# EasyEDA Pro project ProDocument_PCB26_2025-02-21.epro

# Board PCB26
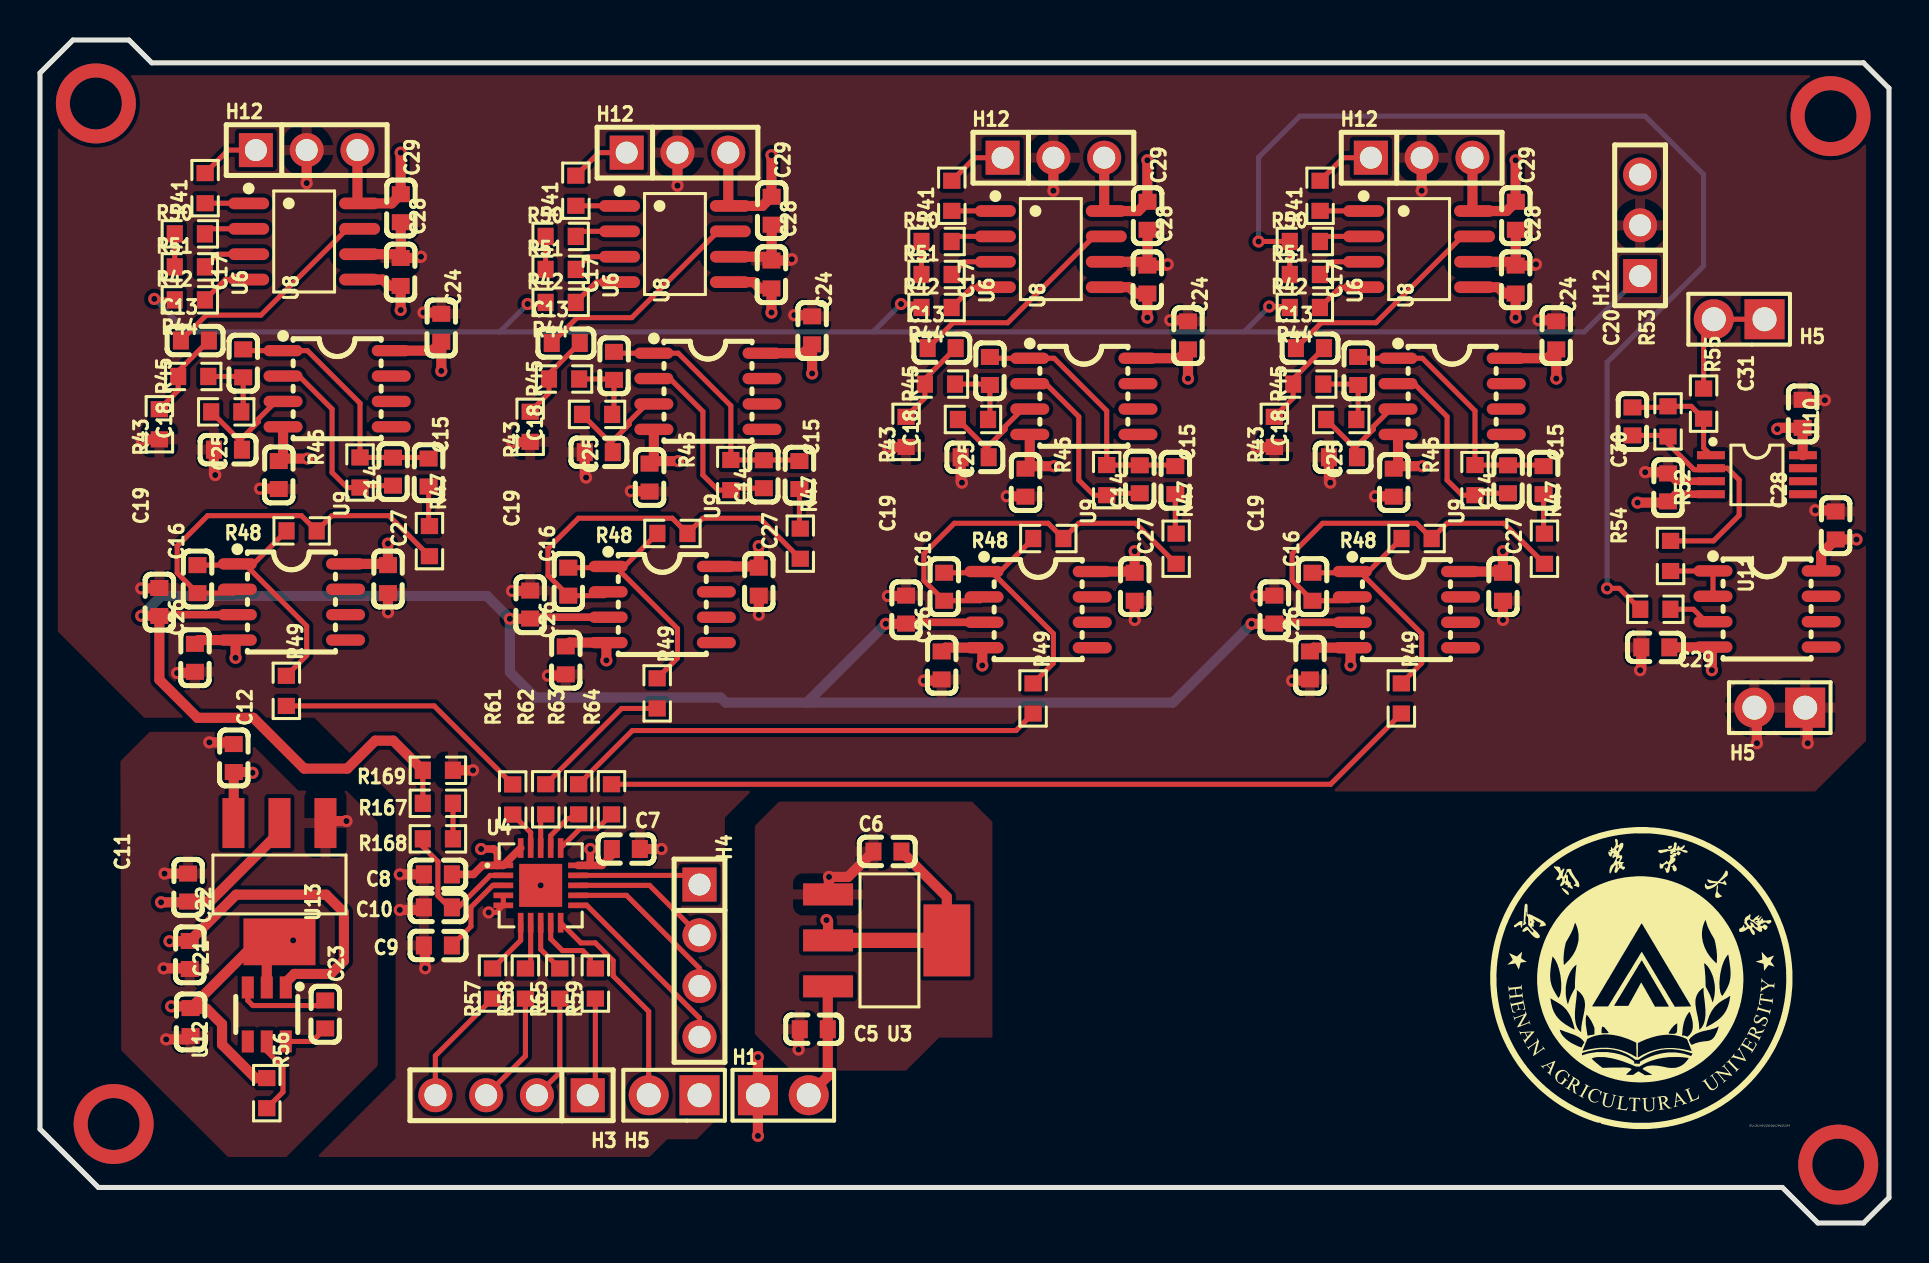
[diagram p0: board, top side]
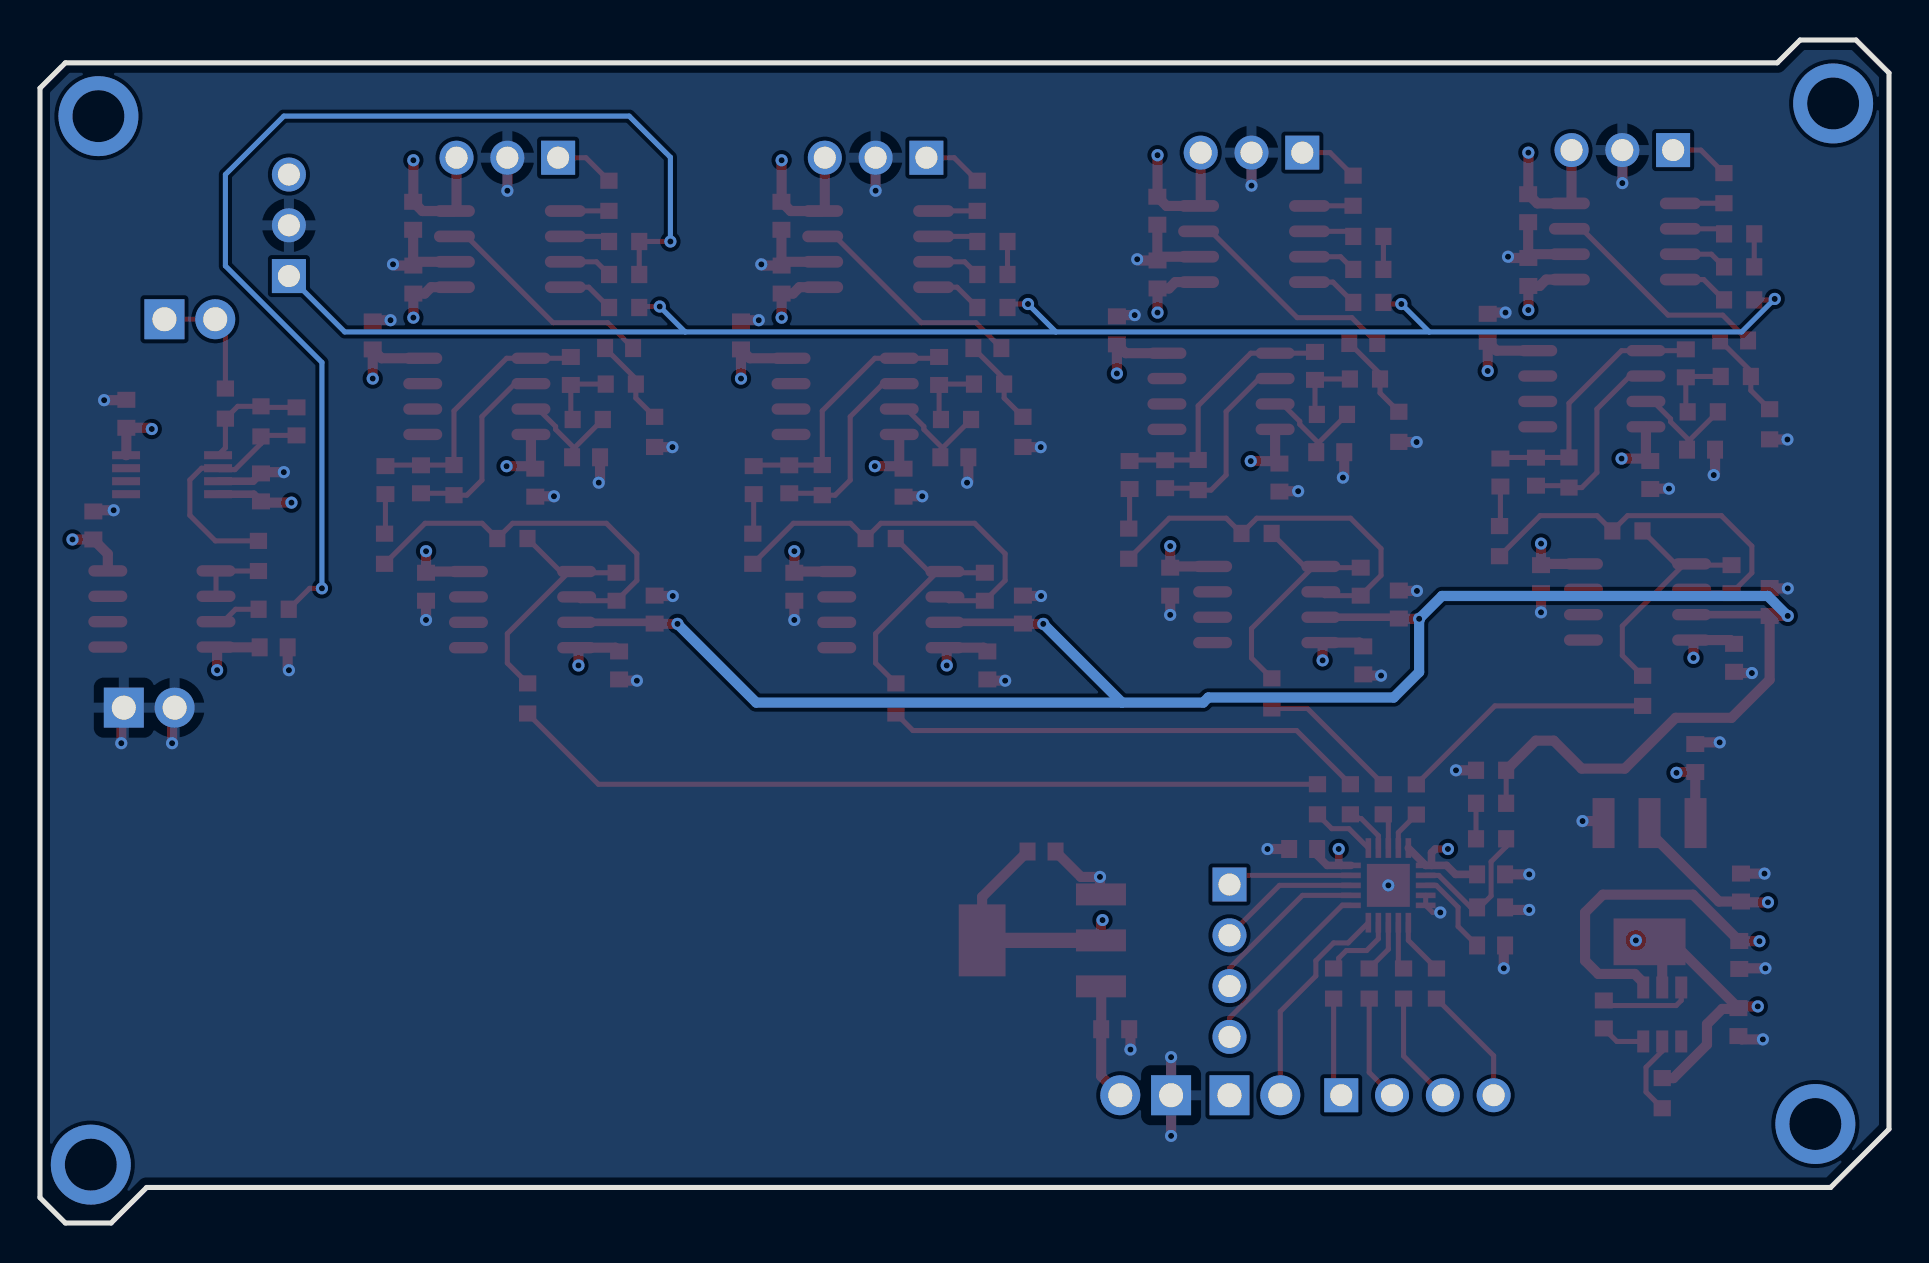
[diagram p1: board, bottom side, seen from below]

Outline 92.46 x 59.18 mm; copper layers: Top Layer, Inner1, Inner2, Bottom Layer. Coordinates in mm from the lower left corner of the outline.
Outline path: 0,57.53 1.65,59.18 4.44,59.18 5.59,58.04 91.19,58.04 92.46,56.77 92.46,1.27 91.19,0 88.9,0 87.12,1.78 2.92,1.78 0,4.7 0,57.53
Stack: Top Layer 0.035mm / Dielectric1 1.51mm FR4 er 4.5 / Inner1 0.035mm / Dielectric2 0.48mm PP er 4.5 / Inner2 0.035mm / Dielectric3 0.48mm PP er 4.5 / Bottom Layer 0.035mm

## Design rules (mm)
template: JLCPCB Capability(Two Layers Board)
spacing copperThickness1oz (default): track to track 0.102, other pairs 0.152 to 0.3
spacing copperThickness2oz: track to track 0.203, other pairs 0.152 to 0.3
track width copperThickness1oz (default): min 0.127, default 0.254, max 2.54
track width copperThickness2oz: min 0.203, default 0.254, max 2.54
differential pair differentialPair (default): width min 0.127, default 0.254, max 2.54; gap min 0.152, default 0.152
via viaSize (default): diameter min 0.5, default 0.61, max 10; hole min 0.3, default 0.305, max 6.3

## Placement (name value [footprint] x y rotation side)
C5  10uF  [C0603]  38.69 9.69 0 top
C6  22uF  [C0603]  42.38 18.58 0 top
C7  100nF  [C0603]  29.29 18.71 180 top
C8  100nF  [C0603]  19.9 17.44 0 top
C9  100nF  [C0603]  19.9 13.88 180 top
C10  100nF  [C0603]  19.9 15.79 180 top
C11  22uF  [C0603]  7.4 16.78 270 top
C12  10uF  [C0603]  9.69 23.26 270 top
C13  -  [C0603]  7.75 44.15 180 top
C13#2  -  [C0603]  26.29 44.02 180 top
C13#3  -  [C0603]  63.5 43.77 180 top
C13#4  -  [C0603]  45.09 43.77 180 top
C14  -  [C0603]  17.65 37.59 270 top
C14#2  -  [C0603]  54.99 37.2 270 top
C14#3  -  [C0603]  36.19 37.46 270 top
C14#4  -  [C0603]  73.41 37.2 270 top
C15  -  [C0603]  19.43 37.54 90 top
C15#2  -  [C0603]  37.97 37.42 90 top
C15#3  -  [C0603]  56.77 37.16 90 top
C15#4  -  [C0603]  75.18 37.16 90 top
C16  -  [C0603]  63.63 31.83 270 top
C16#2  -  [C0603]  7.87 32.21 270 top
C16#3  -  [C0603]  26.42 32.08 270 top
C16#4  -  [C0603]  45.21 31.83 270 top
C17  -  [C0603]  10.16 43.01 270 top
C17#2  -  [C0603]  28.7 42.88 270 top
C17#3  -  [C0603]  65.91 42.62 270 top
C17#4  -  [C0603]  47.5 42.62 270 top
C18  -  [C0603]  27.94 38.56 180 top
C18#2  -  [C0603]  9.4 38.69 180 top
C18#3  -  [C0603]  65.15 38.31 180 top
C18#4  -  [C0603]  46.74 38.31 180 top
C19  -  [C0603]  61.72 30.69 90 top
C19#2  -  [C0603]  5.97 31.07 90 top
C19#3  -  [C0603]  24.51 30.94 90 top
C19#4  -  [C0603]  43.31 30.69 90 top
C20  68pF  [C0603]  79.63 40.1 90 top
C21  4.7uF  [C0603]  7.53 10.05 270 top
C22  4.7uF  [C0603]  7.49 13.41 270 top
C23  4.7uF  [C0603]  14.26 10.43 270 top
C24  -  [C0603]  20.07 44.78 90 top
C24#2  -  [C0603]  38.61 44.66 90 top
C24#3  -  [C0603]  57.4 44.4 90 top
C24#4  -  [C0603]  75.82 44.4 90 top
C25  -  [C0603]  11.94 37.42 270 top
C25#2  -  [C0603]  49.28 37.04 270 top
C25#3  -  [C0603]  30.48 37.29 270 top
C25#4  -  [C0603]  67.69 37.04 270 top
C26  -  [C0603]  7.75 28.27 270 top
C26#2  -  [C0603]  63.5 27.89 270 top
C26#3  -  [C0603]  26.29 28.15 270 top
C26#4  -  [C0603]  45.09 27.89 270 top
C27  -  [C0603]  17.4 32.21 270 top
C27#2  -  [C0603]  73.15 31.83 270 top
C27#3  -  [C0603]  35.94 32.08 270 top
C27#4  -  [C0603]  54.74 31.83 270 top
C28  -  [C0603]  89.79 34.89 90 top
C28#2  -  [C0603]  18.03 47.58 90 top
C28#3  -  [C0603]  36.58 47.45 90 top
C28#4  -  [C0603]  73.79 47.2 90 top
C28#5  -  [C0603]  55.37 47.2 90 top
C29  -  [C0603]  18.04 50.77 270 top
C29#2  -  [C0603]  80.77 28.8 180 top
C29#3  -  [C0603]  36.59 50.64 270 top
C29#4  -  [C0603]  55.38 50.39 270 top
C29#5  -  [C0603]  73.8 50.39 270 top
C30  100nF  [C0603]  81.41 36.8 90 top
C31  100nF  [C0603]  88.14 40.48 90 top
H1  PZ254V-11-02P  [HDR-TH_2P-P2.54-V-M]  37.17 6.39 0 top
H3  PZ254V-11-04P  [HDR-TH_4P-P2.54-V-M]  23.58 6.39 180 top
H4  PZ254V-11-04P  [HDR-TH_4P-P2.54-V-M]  32.98 13.12 270 top
H5  -  [HDR-TH_2P-P2.54-V-M]  31.71 6.39 180 top
H5#2  -  [HDR-TH_2P-P2.54-V-M]  84.96 45.21 180 top
H5#3  -  [HDR-TH_2P-P2.54-V-M]  87 25.78 180 top
H12  -  [HDR-TH_3P-P2.54-V-M]  50.67 53.29 0 top
H12#2  -  [HDR-TH_3P-P2.54-V-M]  13.33 53.67 0 top
H12#3  -  [HDR-TH_3P-P2.54-V-M]  80.01 49.91 90 top
H12#4  -  [HDR-TH_3P-P2.54-V-M]  31.88 53.55 0 top
H12#5  -  [HDR-TH_3P-P2.54-V-M]  69.09 53.29 0 top
R41  -  [R0603]  8.25 51.77 90 top
R41#2  -  [R0603]  45.59 51.39 90 top
R41#3  -  [R0603]  26.8 51.64 90 top
R41#4  -  [R0603]  64.01 51.39 90 top
R42  -  [R0603]  7.49 46.18 180 top
R42#2  -  [R0603]  26.03 46.05 180 top
R42#3  -  [R0603]  63.25 45.8 180 top
R42#4  -  [R0603]  44.83 45.8 180 top
R43  -  [R0603]  24.51 39.83 270 top
R43#2  -  [R0603]  5.97 39.96 270 top
R43#3  -  [R0603]  43.31 39.58 270 top
R43#4  -  [R0603]  61.72 39.58 270 top
R44  -  [R0603]  7.66 42.35 0 top
R44#2  -  [R0603]  26.2 42.22 0 top
R44#3  -  [R0603]  63.42 41.97 0 top
R44#4  -  [R0603]  45 41.97 0 top
R45  -  [R0603]  9.31 40.58 180 top
R45#2  -  [R0603]  27.86 40.45 180 top
R45#3  -  [R0603]  65.07 40.2 180 top
R45#4  -  [R0603]  46.65 40.2 180 top
R46  -  [R0603]  34.54 37.42 90 top
R46#2  -  [R0603]  16 37.54 90 top
R46#3  -  [R0603]  53.34 37.16 90 top
R46#4  -  [R0603]  71.75 37.16 90 top
R47  -  [R0603]  19.47 34.11 270 top
R47#2  -  [R0603]  75.23 33.73 270 top
R47#3  -  [R0603]  56.81 33.73 270 top
R47#4  -  [R0603]  38.02 33.98 270 top
R48  -  [R0603]  13.08 34.62 180 top
R48#2  -  [R0603]  31.62 34.5 180 top
R48#3  -  [R0603]  68.83 34.24 180 top
R48#4  -  [R0603]  50.42 34.24 180 top
R49  -  [R0603]  12.32 26.62 270 top
R49#2  -  [R0603]  30.86 26.5 270 top
R49#3  -  [R0603]  68.07 26.24 270 top
R49#4  -  [R0603]  49.66 26.24 270 top
R50  -  [R0603]  7.49 49.48 180 top
R50#2  -  [R0603]  26.03 49.36 180 top
R50#3  -  [R0603]  63.25 49.1 180 top
R50#4  -  [R0603]  44.83 49.1 180 top
R51  -  [R0603]  7.49 47.83 180 top
R51#2  -  [R0603]  26.03 47.7 180 top
R51#3  -  [R0603]  63.25 47.45 180 top
R51#4  -  [R0603]  44.83 47.45 180 top
R52  10kΩ  [R0603]  81.53 33.37 270 top
R53  470kΩ  [R0603]  81.41 40.1 270 top
R54  0Ω  [R0603]  80.77 30.7 180 top
R55  470kΩ  [R0603]  83.19 40.99 270 top
R56  10kΩ  [R0603]  11.34 6.5 90 top
R57  0Ω  [R0603]  22.63 11.98 270 top
R58  0Ω  [R0603]  24.27 11.98 270 top
R59  0Ω  [R0603]  27.77 11.98 270 top
R61  0Ω  [R0603]  23.64 21.19 270 top
R62  0Ω  [R0603]  25.29 21.2 270 top
R63  0Ω  [R0603]  26.93 21.2 90 top
R64  0Ω  [R0603]  28.58 21.2 90 top
R65  0Ω  [R0603]  25.99 11.98 90 top
R167  470kΩ  [R0603]  19.9 21 180 top
R168  0Ω  [R0603]  19.9 19.22 0 top
R169  470kΩ  [R0603]  19.9 22.65 0 top
U3  AMS1117-3.3  [SOT-223-3_L6.4-W3.5-P2.30-LS7.0-BR]  42.38 14.14 180 top
U4  AD7689BCPZ  [LFCSP-20_L4.0-W4.0-P0.50-TL-EP2.7]  25.03 16.89 0 top
U6  -  [SOIC-8_L4.9-W3.9-P1.27-LS6.0-BL]  13.21 49.1 270 top
U6#2  -  [SOIC-8_L4.9-W3.9-P1.27-LS6.0-BL]  31.75 48.97 270 top
U6#3  -  [SOIC-8_L4.9-W3.9-P1.27-LS6.0-BL]  50.55 48.72 270 top
U6#4  -  [SOIC-8_L4.9-W3.9-P1.27-LS6.0-BL]  68.96 48.72 270 top
U8  -  [SOIC-8_L4.9-W3.9-P1.27-LS6.1-BL]  14.86 41.74 270 top
U8#2  -  [SOIC-8_L4.9-W3.9-P1.27-LS6.1-BL]  33.4 41.61 270 top
U8#3  -  [SOIC-8_L4.9-W3.9-P1.27-LS6.1-BL]  70.61 41.35 270 top
U8#4  -  [SOIC-8_L4.9-W3.9-P1.27-LS6.1-BL]  52.2 41.35 270 top
U9  -  [SOIC-8_L4.9-W3.9-P1.27-LS6.1-BL]  12.57 31.07 270 top
U9#2  -  [SOIC-8_L4.9-W3.9-P1.27-LS6.1-BL]  31.12 30.94 270 top
U9#3  -  [SOIC-8_L4.9-W3.9-P1.27-LS6.1-BL]  49.91 30.69 270 top
U9#4  -  [SOIC-8_L4.9-W3.9-P1.27-LS6.1-BL]  68.33 30.69 270 top
U10  OP2177ARMZ-REEL  [MSOP-8_L3.0-W3.0-P0.65-LS4.9-BL]  85.85 37.43 270 top
U11  TL072CDR  [SOIC-8_L4.9-W3.9-P1.27-LS6.1-BL]  86.36 30.72 270 top
U12  SGM3204YN6G/TR  [SOT-23-6_L2.9-W1.6-P0.95-LS2.8-BR]  11.34 10.43 90 top
U13  AMS1117-3.3  [SOT-223-3_L6.4-W3.5-P2.30-LS7.0-BR]  11.97 17.04 90 top

## Footprints (pads in the part's own frame, mm; a bottom-side part is the same pattern mirrored in y, then rotated)
C0603
  rect 0.8x0.9 smd: 1(-0.7,0) 2(0.7,0)
HDR-TH_2P-P2.54-V-M
  rect 2x2 hole 1.2: 1(-1.27,0)
  round 2 hole 1.2: 2(1.27,0)
HDR-TH_3P-P2.54-V-M
  rect 1.7x1.7 hole 1.1: 1(-2.54,0)
  round 1.7 hole 1.1: 2(0,0) 3(2.54,0)
HDR-TH_4P-P2.54-V-M
  rect 1.7x1.7 hole 1.1: 1(-3.81,0)
  round 1.7 hole 1.1: 2(-1.27,0) 3(1.27,0) 4(3.81,0)
LFCSP-20_L4.0-W4.0-P0.50-TL-EP2.7
  rect 0.985x0.28 smd: 1(-1.867,1) 2(-1.867,0.5) 3(-1.867,0) 4(-1.867,-0.5) 5(-1.867,-1) 11(1.867,-1) 12(1.867,-0.5) 13(1.867,0) 14(1.867,0.5) 15(1.867,1)
  rect 0.28x0.985 smd: 6(-1,-1.867) 7(-0.5,-1.867) 8(0,-1.867) 9(0.5,-1.867) 10(1,-1.867) 16(1,1.867) 17(0.5,1.867) 18(0,1.867) 19(-0.5,1.867) 20(-1,1.867)
  rect 2.15x2.15 smd: 21(0,0)
MSOP-8_L3.0-W3.0-P0.65-LS4.9-BL
  rect 0.406x1.397 smd: 1(-0.975,-2.3) 2(-0.325,-2.3) 3(0.325,-2.3) 4(0.975,-2.3) 5(0.975,2.3) 6(0.325,2.3) 7(-0.325,2.3) 8(-0.975,2.3)
R0603
  rect 0.806x0.864 smd: 1(-0.753,0) 2(0.753,0)
SOIC-8_L4.9-W3.9-P1.27-LS6.0-BL
  oval 0.588x2.045 smd: 1(-1.905,-2.772) 2(-0.635,-2.772) 3(0.635,-2.772) 4(1.905,-2.772) 5(1.905,2.772) 6(0.635,2.772) 7(-0.635,2.772) 8(-1.905,2.772)
SOIC-8_L4.9-W3.9-P1.27-LS6.1-BL
  oval 0.569x1.95 smd: 1(-1.905,-2.705) 2(-0.635,-2.705) 3(0.635,-2.705) 4(1.905,-2.705) 5(1.905,2.705) 6(0.635,2.705) 7(-0.635,2.705) 8(-1.905,2.705)
SOT-23-6_L2.9-W1.6-P0.95-LS2.8-BR
  rect 1.1x0.6 smd: 1(1.35,-0.95) 2(1.35,0) 3(1.35,0.95) 4(-1.35,0.95) 5(-1.35,0) 6(-1.35,-0.95)
SOT-223-3_L6.4-W3.5-P2.30-LS7.0-BR
  rect 2.5x1.1 smd: 1(2.97,-2.3) 2(2.97,0) 3(2.97,2.3)
  rect 2.34x3.6 smd: 4(-2.97,0)

## Nets
+3.3V: C6.2 C7.2 U3.2 U3.4 U4.15
+5V: C5.2 C12.2 H1.2 U3.3 U13.3
AVCC: C8.2 C11.2 C21.1 C24.1 C24#2.1 C24#3.1 C24#4.1 C27.1 C27#2.1 C27#3.1 C27#4.1 C28.1 C29.1 C29#3.1 C29#4.1 C29#5.1 C31.1 H12.3 H12#2.3 H12#3.3 H12#4.3 H12#5.3 R56.2 U4.1 U4.20 U6.8 U6#2.8 U6#3.8 U6#4.8 U8.8 U8#2.8 U8#3.8 U8#4.8 U9.8 U9#2.8 U9#3.8 U9#4.8 U10.8 U11.8 U12.2 U13.2 U13.4
AVEE: C22.1 C25.1 C25#2.1 C25#3.1 C25#4.1 C26.1 C26#2.1 C26#3.1 C26#4.1 C28#2.1 C28#3.1 C28#4.1 C28#5.1 C29#2.1 C30.1 U6.5 U6#2.5 U6#3.5 U6#4.5 U8.4 U8#2.4 U8#3.4 U8#4.4 U9.4 U9#2.4 U9#3.4 U9#4.4 U10.4 U11.4 U12.1
GND: C5.1 C6.1 C7.1 C8.1 C9.2 C10.2 C11.1 C12.1 C18.2 C18#2.2 C18#3.2 C18#4.2 C19.2 C19#2.2 C19#3.2 C19#4.2 C21.2 C22.2 C24.2 C24#2.2 C24#3.2 C24#4.2 C25.2 C25#2.2 C25#3.2 C25#4.2 C26.2 C26#2.2 C26#3.2 C26#4.2 C27.2 C27#2.2 C27#3.2 C27#4.2 C28.2 C28#2.2 C28#3.2 C28#4.2 C28#5.2 C29.2 C29#2.2 C29#3.2 C29#4.2 C29#5.2 C30.2 C31.2 H1.1 H5#3.1 H5#3.2 H12.2 H12#2.2 H12#3.2 H12#4.2 H12#5.2 R43.2 R43#2.2 R43#3.2 R43#4.2 R169.2 U3.1 U4.4 U4.5 U4.21 U6.6 U6#2.6 U6#3.6 U6#4.6 U10.3 U13.1
ARF: C19.1 C19#2.1 C19#3.1 C19#4.1 R167.2 R169.1 U9.3 U9#2.3 U9#3.3 U9#4.3
COM: H5.2 U4.10
CVN: H4.4 U4.11
DIN: H4.3 U4.12
IN1: R49.2 R61.1
IN2: R49#2.2 R62.1
IN3: R49#4.2 R63.2
IN4: R49#3.2 R64.2
SCK: H4.2 U4.13
SDO: H4.1 U4.14
$1N550: R52.2 U11.1 U11.2
$1N551: R54.1 U11.3
$1N563: R50#3.2 R51#3.2 R54.2
$1N579: R56.1 U12.5
$1N581: C23.1 U12.3
$1N582: C23.2 U12.6
$1N1171: R41.1 R41#2.1 R41#3.1 R41#4.1 U6.1 U6#2.1 U6#3.1 U6#4.1
$1N1172: R42.1 R42#2.1 R42#3.1 R42#4.1 U6.4 U6#2.4 U6#3.4 U6#4.4
$1N1174: C14.2 C14#2.2 C14#3.2 C14#4.2 R46.1 R46#2.1 R46#3.1 R46#4.1 U8.2 U8#2.2 U8#3.2 U8#4.2
$1N1175: C13.1 C13#2.1 C13#3.1 C13#4.1 R43.1 R43#2.1 R43#3.1 R43#4.1 R44.1 R44#2.1 R44#3.1 R44#4.1
$1N1177: C13.2 C13#2.2 C13#3.2 C13#4.2 U6.7 U6#2.7 U6#3.7 U6#4.7
$1N1178: C15.1 C15#2.1 C15#3.1 C15#4.1 R47.1 R47#2.1 R47#3.1 R47#4.1
$1N1179: C16.2 C16#2.2 C16#3.2 C16#4.2 R47.2 R47#2.2 R47#3.2 R47#4.2 R48.1 R48#2.1 R48#3.1 R48#4.1 U9.2 U9#2.2 U9#3.2 U9#4.2
$1N1180: C16.1 C16#2.1 C16#3.1 C16#4.1 R48.2 R48#2.2 R48#3.2 R48#4.2 R49.1 R49#2.1 R49#3.1 R49#4.1 U9.1 U9#2.1 U9#3.1 U9#4.1
$1N1181: C14.1 C14#2.1 C14#3.1 C14#4.1 C15.2 C15#2.2 C15#3.2 C15#4.2 C17.1 C17#2.1 C17#3.1 C17#4.1 R46.2 R46#2.2 R46#3.2 R46#4.2 U8.1 U8#2.1 U8#3.1 U8#4.1
$1N1182: C17.2 C17#2.2 C17#3.2 C17#4.2 R44.2 R44#2.2 R44#3.2 R44#4.2 R45.1 R45#2.1 R45#3.1 R45#4.1
$1N1184: C18.1 C18#2.1 C18#3.1 C18#4.1 R45.2 R45#2.2 R45#3.2 R45#4.2 U8.3 U8#2.3 U8#3.3 U8#4.3
$1N1186: R50.1 R50#2.1 R50#3.1 R50#4.1 U6.2 U6#2.2 U6#3.2 U6#4.2
$1N1187: R51.1 R51#2.1 R51#3.1 R51#4.1 U6.3 U6#2.3 U6#3.3 U6#4.3
$1N1199: R50.2 R50#2.2 R50#4.2 R51.2 R51#2.2 R51#4.2
$1N1200: H12.1 H12#2.1 H12#4.1 H12#5.1 R41.2 R41#2.2 R41#3.2 R41#4.2
$1N1286: C9.1 U4.3
$1N1288: R57.1 U4.6
$1N1289: R58.1 U4.7
$1N1290: R59.1 U4.9
$1N1291: R61.2 U4.19
$1N1292: R62.2 U4.18
$1N1293: R63.1 U4.17
$1N1294: R64.1 U4.16
$1N1295: R65.2 U4.8
$1N1305: C10.1 R168.1 U4.2
$1N1306: R167.1 R168.2
$1N1316: H3.4 R57.2
$1N1581: H5#2.1 H5#2.2 R55.1
$1N2313: C20.1 R52.1 R53.2 U10.2
$1N2328: C20.2 R53.1 R55.2 U10.1
$1N6910: H3.3 R58.2
$1N6915: H3.2 R65.1
$1N6920: H3.1 R59.2
$1N10831: H12#3.1 R42.2 R42#2.2 R42#3.2 R42#4.2

Pads without a net: H5 1; U8 5 6 7; U8#2 5 6 7; U8#3 5 6 7; U8#4 5 6 7; U9 5 6 7; U9#2 5 6 7; U9#3 5 6 7; U9#4 5 6 7; U10 5 6 7; U11 5 6 7; U12 4

## Via types
v1: diameter 4, hole 2.6, Top Layer to Bottom Layer, 4 vias
v2: diameter 0.61, hole 0.305, Top Layer to Bottom Layer, 104 vias

## Routing (per net, layer and track width the routed paths; a pad name or vN(x,y) marks a point on that pad's centre or on a via; arc(x,y) is an arc through that point)
+3.3V: length 28.7
  Top Layer w0.381: 27.4,17.89 27.52,18.01 v2(27.52,18.71) ; 27.4,17.89 U4.15 ; 27.4,17.89 28.09,17.89 28.59,18.39 C7.2
  Top Layer w0.508: C6.2 45.35,16.31 U3.4 ; U3.2 39.41,15.08 v2(39.33,15.15)
  Top Layer w0.762: U3.2 U3.4
  Inner1 w0.508: v2(27.52,18.71) 30.55,15.68 38.81,15.68 v2(39.33,15.15)
+5V: length 64.9
  Top Layer w0.508: H1.2 39.39,7.35 C5.2 39.39,11.83 U3.3 ; v2(10.63,22.52) 10.59,22.56 C12.2 9.69,20.02 U13.3
  Inner1 w0.508: H1.2 38.44,4.11 37.93,3.6 10.63,3.6 4.32,9.91 4.32,18.03 8.81,22.52 v2(10.63,22.52)
AVCC: length 362.4
  Top Layer w0.381: 22.88,17.89 U4.1 U4.20 ; 22.88,17.89 22.12,17.89 21.67,17.44 C8.2 ; 22.88,17.89 22.88,18.53 22.69,18.71 v2(22.06,18.71)
  Top Layer w0.508: v2(90.83,34.19) C28.1 89.06,33.47 89.06,32.62 ; U10.8 88.14,38.42 C31.1 86.93,39.78 v2(86.87,39.72) ; v2(54.74,33.61) C27#4.1 54.68,32.59 U9#3.8 ; R56.2 10.78,7.25 9.1,8.93 9.1,9.95 8.34,10.71 7.57,10.71 C21.1 ; C21.1 7.44,10.84 v2(6.56,10.84) ; C21.1 10.84,14.07 U13.4 11.34,13.43 U12.2 ; U9.8 17.34,32.97 C27.1 v2(17.4,33.99) ; v2(55.37,53.17) 55.37,51.1 C29#4.1 54.92,50.63 U6#3.8 53.21,50.73 H12.3 ; H12#5.3 71.63,50.73 U6#4.8 73.34,50.63 C29#5.1 73.79,51.1 v2(73.79,53.17) ; U8#2.8 38.16,43.51 C24#2.1 v2(38.61,42.5) ; v2(18.03,53.55) 18.03,51.48 C29.1 17.58,51.01 U6.8 15.88,51.11 H12#2.3 ; v2(35.94,33.86) C27#3.1 35.88,32.85 U9#2.8 ; U9#4.8 73.09,32.59 C27#2.1 v2(73.15,33.61) ; v2(57.4,42.24) C24#3.1 56.96,43.26 U8#4.8 ; v2(20.07,42.62) C24.1 19.62,43.64 U8.8 ; v2(36.58,53.42) 36.58,51.35 36.59,51.34 36.12,50.88 U6#2.8 34.42,50.98 H12#4.3 ; v2(6.05,16.04) 7.36,16.04 C11.2 8.51,16.08 11.97,19.55 U13.2 ; v2(75.82,42.24) C24#4.1 75.38,43.26 U8#3.8
  Inner1 w0.508: v2(75.82,42.24) 76.96,43.39 76.96,49.77 ; v2(75.82,42.24) 76.71,41.35 76.71,36.27 ; v2(75.82,42.24) 84.34,42.24 v2(86.87,39.72) 86.87,38.16 87.72,37.31 89.79,37.31 90.83,36.27 v2(90.83,34.19) ; v2(6.05,16.04) 7.11,14.99 7.92,14.99 8.76,14.14 ; 39.75,50.24 v2(36.58,53.42) 33.53,50.37 21.21,50.37 ; 39.75,50.24 39.75,43.64 v2(38.61,42.5) 39.5,41.61 39.5,36.53 38.74,35.77 37.59,35.77 37.08,35.26 37.08,34.54 36.41,33.86 v2(35.94,33.86) ; 39.75,50.24 58.29,50.24 ; 21.21,50.37 21.21,43.77 v2(20.07,42.62) 20.95,41.74 20.95,36.66 20.19,35.89 19.05,35.89 18.54,35.39 18.54,34.67 17.86,33.99 v2(17.4,33.99) ; 21.21,50.37 v2(18.03,53.55) ; 8.76,14.14 v2(12.66,14.14) 17.23,18.71 20.15,18.71 ; 8.76,14.14 8.76,13.04 v2(6.56,10.84) ; 76.96,49.77 76.74,49.99 58.55,49.99 ; 76.96,49.77 76.96,49.99 v2(73.79,53.17) 79.3,53.17 H12#3.3 ; 76.71,36.27 75.95,35.51 74.8,35.51 74.29,35 74.29,34.29 73.62,33.61 v2(73.15,33.61) ; 76.71,36.27 76.71,24.89 74.17,22.35 23.79,22.35 20.15,18.71 ; 58.55,49.99 58.55,43.39 v2(57.4,42.24) 58.29,41.35 58.29,36.27 57.53,35.51 56.39,35.51 55.88,35 55.88,34.29 55.2,33.61 v2(54.74,33.61) ; 58.55,49.99 58.29,50.24 ; 58.29,50.24 v2(55.37,53.17) ; 20.15,18.71 v2(22.06,18.71)
AVEE: length 356.8
  Top Layer w0.381: U10.4 81.77,36.46 C30.1
  Top Layer w0.508: 49.4,37.86 C25#2.1 ; 49.4,37.86 v2(50.71,37.86) ; 49.4,37.86 49.49,37.95 U8#4.4 ; U6#4.5 72.9,46.82 73.22,46.5 C28#4.1 v2(73.79,45.29) ; U6#3.5 54.48,46.82 54.8,46.5 C28#5.1 v2(55.37,45.29) ; v2(18.03,45.67) C28#2.1 17.46,46.88 17.14,47.2 U6.5 ; 12.06,38.24 12.15,38.33 U8.4 ; 12.06,38.24 C25.1 ; 12.06,38.24 v2(13.37,38.24) ; 83.64,28.8 83.6,28.76 v2(83.6,27.66) ; 83.64,28.8 U11.4 ; 83.64,28.8 C29#2.1 ; C26#4.1 45.27,28.78 U9#3.4 47.12,28.69 v2(47.12,27.89) ; v2(65.53,27.89) 65.53,28.69 U9#4.4 63.69,28.78 C26#2.1 ; 30.6,38.11 C25#3.1 ; 30.6,38.11 v2(31.91,38.11) ; 30.6,38.11 30.7,38.21 U8#2.4 ; U6#2.5 35.69,47.07 36.01,46.75 C28#3.1 v2(36.58,45.55) ; 67.91,39.45 67.91,37.95 67.81,37.86 ; 67.81,37.86 C25#4.1 ; 67.81,37.86 v2(69.12,37.86) ; U12.1 12.29,12.03 12.72,12.46 14.53,12.46 15.2,13.12 15.2,15.54 14.31,16.42 9.8,16.42 C22.1 7.48,14.1 v2(6.48,14.1) ; C26#3.1 26.48,29.04 U9#2.4 28.32,28.95 v2(28.32,28.15) ; v2(79.88,36.04) 81.34,36.04 C30.1 ; v2(9.78,28.27) 9.78,29.07 U9.4 7.94,29.16 C26.1
  Inner1 w0.508: v2(47.12,27.89) 47.88,27.89 49.45,29.46 ; 49.45,29.46 44.07,29.46 43.05,28.45 32.42,28.45 31.91,28.96 31.91,30.98 ; 49.45,29.46 50.71,30.72 ; 31.91,30.98 31.91,35.02 ; 31.91,30.98 29.08,28.15 v2(28.32,28.15) ; 13.37,31.1 13.37,27.54 ; 13.37,31.1 v2(13.37,38.24) 13.37,41.01 v2(18.03,45.67) ; 13.37,31.1 10.54,28.27 v2(9.78,28.27) 3.43,21.92 3.43,8.89 9.78,2.54 38.35,2.54 53.97,18.16 72.64,18.16 82.14,27.66 v2(83.6,27.66) 83.47,27.78 81.03,27.78 79.88,28.93 v2(79.88,36.04) ; 13.37,27.54 13.88,27.03 17.63,27.03 25.65,35.05 31.88,35.05 31.91,35.02 ; 13.37,27.54 13.37,23.66 11.3,21.59 9.27,21.59 5.33,17.65 5.33,15.24 v2(6.48,14.1) ; v2(55.37,45.29) 50.71,40.63 v2(50.71,37.86) 50.71,30.72 ; v2(36.58,45.55) 31.91,40.88 v2(31.91,38.11) 31.91,35.02 ; 50.71,30.72 52.37,32.38 65.19,32.38 67.99,29.59 ; 67.99,29.59 69.12,30.72 v2(69.12,37.86) 69.12,40.63 v2(73.79,45.29) ; 67.99,29.59 66.29,27.89 v2(65.53,27.89)
GND: length 486.5
  Top Layer w0.254: v2(22.44,15.54) 22.81,15.54 U4.5 U4.4 ; 81.34,37.56 C30.2
  Top Layer w0.381: C30.2 81.8,37.11 U10.3
  Top Layer w0.508: C18#2.2 8.7,37.48 v2(8.76,37.42) ; v2(89.25,41.16) 88.16,41.16 C31.2 ; v2(29.54,36.61) 30.46,36.61 C25#3.2 ; H12.2 v2(50.67,51.64) ; v2(46.1,37.04) 46.04,37.1 C18#4.2 ; v2(48.34,36.36) 49.26,36.36 C25#2.2 ; C25#4.2 67.67,36.36 v2(66.76,36.36) ; v2(56.39,47.96) 56.33,47.9 C28#5.2 ; C5.1 37.93,9.63 v2(37.93,8.68) ; v2(80.26,37.56) 81.34,37.56 ; C24#2.2 38.55,45.42 v2(37.72,45.42) ; U3.1 39.45,16.49 v2(39.45,17.31) 40.41,17.31 C6.1 ; C29#5.2 73.8,47.91 C28#4.2 ; U6#2.6 36.39,48.34 C28#3.2 ; v2(73.15,30.17) 73.15,30.17 C27#2.2 ; C19.2 61.7,31.37 v2(60.82,31.37) ; C18.2 27.24,37.36 v2(27.31,37.29) ; v2(85.85,24) 85.85,25.65 H5#3.2 ; v2(64.52,37.04) 64.45,37.1 C18#3.2 ; C28#4.2 74.74,47.9 v2(74.8,47.96) ; C28#4.2 73.6,48.09 U6#4.6 ; v2(19.05,48.34) 18.99,48.28 C28#2.2 ; v2(44.2,27.13) 45.02,27.13 C26#4.2 ; v2(5.06,31.75) 5.95,31.75 C19#2.2 ; v2(56.51,45.16) 57.34,45.16 C24#3.2 ; v2(5.08,39.2) 5.96,39.2 R43#2.2 ; v2(6.86,27.51) 7.69,27.51 C26.2 ; C29#3.2 36.59,48.16 C28#3.2 ; v2(17.99,15.66) 19.2,15.66 ; C27#4.2 54.74,30.17 v2(54.74,30.17) ; v2(42.42,38.81) 43.3,38.81 R43#3.2 ; v2(17.4,30.55) 17.4,30.55 C27.2 ; C19#3.2 24.49,31.62 v2(23.61,31.62) ; v2(88.39,24) 88.39,25.65 88.26,25.78 ; v2(42.4,31.37) 43.29,31.37 C19#4.2 ; v2(31.08,18.71) 31.07,18.71 C7.1 ; C28#2.2 18.04,48.29 C29.2 ; C28#2.2 17.84,48.47 U6.6 ; C11.1 7.4,17.48 v2(6.23,17.48) ; U13.1 14.38,20.11 v2(15.32,20.11) ; v2(25.4,27.38) 26.23,27.38 C26#3.2 ; R43#4.2 61.71,38.81 v2(60.83,38.81) ; H12#4.2 v2(31.88,51.9) ; v2(35.9,4.36) H1.1 v2(35.9,8.3) ; v2(6.18,12.74) 7.46,12.74 C22.2 ; v2(88.77,35.66) 89.73,35.66 C28.2 ; C12.1 9.6,24.04 v2(8.47,24.04) ; C27#3.2 35.94,30.43 v2(35.94,30.42) ; v2(19.18,45.55) 20,45.55 C24.2 ; R43.2 24.5,39.07 v2(23.62,39.07) ; C29#2.2 80.07,27.72 v2(80.01,27.66) ; C28#3.2 37.53,48.15 v2(37.59,48.21) ; C24#4.2 75.76,45.16 v2(74.93,45.16) ; C26#2.2 63.44,27.13 v2(62.61,27.13) ; C25.2 11.92,36.74 v2(11,36.74) ; C9.2 19.26,13.82 v2(19.26,12.74) ; v2(17.99,17.44) C8.1 ; C28#5.2 55.38,47.91 C29#4.2 ; C28#5.2 55.18,48.09 U6#3.6 ; H12#5.2 v2(69.09,51.64) ; R169.2 v2(21.65,22.65) ; v2(6.31,9.19) 7.36,9.19 C21.2 ; H12#2.2 v2(13.33,52.02)
  Inner2 w0.508: v2(31.88,51.9) 35.56,48.21 v2(37.59,48.21) 37.59,45.55 v2(37.72,45.42) 29.54,37.24 v2(29.54,36.61) ; v2(74.8,47.96) 78.06,47.96 H12#3.2 ; v2(74.8,47.96) 74.8,45.29 v2(74.93,45.16) 66.76,36.99 v2(66.76,36.36) ; v2(74.8,47.96) 72.77,47.96 v2(69.09,51.64) ; 77.99,27.66 v2(80.01,27.66) 80.77,27.66 v2(88.77,35.66) ; 77.99,27.66 75.67,27.66 v2(73.15,30.17) 72.94,30.17 v2(66.76,36.36) ; 77.99,27.66 81.64,24 v2(85.85,24) v2(88.39,24) ; v2(13.33,52.02) 17.02,48.34 v2(19.05,48.34) 19.05,45.67 v2(19.18,45.55) 11,37.37 v2(11,36.74) ; v2(27.31,37.29) 27.31,35.32 ; v2(27.31,37.29) 25.4,37.29 v2(23.62,39.07) ; v2(27.31,37.29) 27.99,36.61 v2(29.54,36.61) ; 27.31,35.32 27.31,29.29 ; 27.31,35.32 v2(23.61,31.62) ; v2(66.76,36.36) 65.2,36.36 v2(64.52,37.04) ; 46.1,29.04 64.52,29.04 ; 46.1,29.04 27.56,29.04 27.31,29.29 ; 46.1,29.04 v2(44.2,27.13) ; 46.1,29.04 46.1,35.07 ; 64.52,29.04 v2(62.61,27.13) ; 64.52,29.04 64.52,35.07 ; v2(48.34,36.36) 48.34,36.99 v2(56.51,45.16) 56.39,45.29 v2(56.39,47.96) 54.36,47.96 v2(50.67,51.64) ; v2(48.34,36.36) 46.78,36.36 v2(46.1,37.04) ; v2(48.34,36.36) 54.53,30.17 v2(54.74,30.17) ; v2(46.1,37.04) 46.1,35.07 ; v2(46.1,37.04) 44.2,37.04 v2(42.42,38.81) ; 46.1,35.07 v2(42.4,31.37) ; v2(8.47,24.04) 6.6,25.91 6.6,27.26 v2(6.86,27.51) 8.76,29.42 8.76,35.45 ; v2(8.47,24.04) 12.91,24.04 15.32,21.63 v2(15.32,20.11) v2(17.99,17.44) ; v2(8.47,24.04) 8.47,19.72 v2(6.23,17.48) 5.16,16.42 5.16,13.76 v2(6.18,12.74) 5.42,11.98 5.42,10.07 v2(6.31,9.19) ; v2(64.52,37.04) 62.61,37.04 v2(60.83,38.81) ; v2(64.52,37.04) 64.52,35.07 ; 8.76,35.45 v2(5.06,31.75) ; 8.76,35.45 v2(8.76,37.42) ; v2(35.9,8.3) 37.55,8.3 v2(37.93,8.68) 37.17,9.44 37.17,16.81 37.68,17.31 v2(39.45,17.31) 38.06,18.71 v2(31.08,18.71) 29.26,16.89 v2(25.03,16.89) 20.89,12.74 v2(19.26,12.74) ; 64.52,35.07 v2(60.82,31.37) ; v2(11,36.74) 9.44,36.74 v2(8.76,37.42) ; v2(11,36.74) 17.19,30.55 v2(17.4,30.55) ; v2(88.77,35.66) 89.25,36.13 v2(89.25,41.16) ; v2(88.77,35.66) 82.17,35.66 v2(80.26,37.56) ; 27.31,29.29 v2(25.4,27.38) 25.4,26.4 v2(21.65,22.65) 21.65,22.24 17.99,18.58 v2(17.99,17.44) ; v2(29.54,36.61) 35.73,30.42 v2(35.94,30.42) ; v2(17.99,17.44) v2(17.99,15.66) 17.99,14.01 v2(19.26,12.74) ; v2(22.44,15.54) 22.06,15.54 v2(19.26,12.74) ; v2(8.76,37.42) 6.86,37.42 v2(5.08,39.2)
(no net):
  vias: v1(2.79,56.01) v1(3.68,4.95) v1(89.53,55.37) v1(89.92,2.92)
ARF: length 108.4
  Top Layer w0.254: R169.1 R167.2
  Top Layer w0.381: 43.18,29.86 43.24,29.86 43.43,30.05 U9#3.3 ; U9#2.3 24.64,30.31 24.45,30.11 24.38,30.11 ; 5.84,30.24 5.9,30.24 6.1,30.43 U9.3 ; U9#4.3 61.85,30.05 61.66,29.86 61.59,29.86
  Top Layer w0.508: R169.1 17.66,24.13 16.76,24.13 15.37,22.73 13.21,22.73 10.67,25.27 7.87,25.27 5.97,27.18 5.97,30.31 ; C19#2.1 5.96,30.37 v2(5.06,30.37) ; C19#3.1 24.5,30.23 v2(23.5,30.23) ; v2(60.58,29.97) 61.71,29.97 C19.1 ; C19#4.1 43.29,29.97 v2(42.29,29.97)
  Bottom Layer w0.508: 38.35,26.03 56.64,26.03 v2(60.58,29.97) ; 38.35,26.03 34.29,26.03 34.04,26.29 24.77,26.29 23.5,27.56 v2(23.5,30.23) 22.35,31.37 6.06,31.37 v2(5.06,30.37) ; 38.35,26.03 v2(42.29,29.97)
COM: length 10.9
  Top Layer w0.254: U4.10 27.05,14.01 27.77,14.01 28.66,13.12 28.66,12.36 30.44,10.58 H5.2
CVN: length 9.4
  Top Layer w0.254: U4.11 27.34,15.89 32.98,10.26 H4.4
DIN: length 8.5
  Top Layer w0.254: U4.12 29.33,16.39 32.98,12.74 H4.3
IN1: length 12.9
  Top Layer w0.254: R61.1 19.71,25.87 R49.2
IN2: length 7.1
  Top Layer w0.254: R49#2.2 29.08,25.74 R62.1
IN3: length 24.2
  Top Layer w0.254: R49#4.2 48.81,24.64 29.62,24.64 R63.2
IN4: length 41
  Top Layer w0.254: R49#3.2 64.53,21.95 R64.2
SCK: length 7.1
  Top Layer w0.254: H4.2 30.48,16.89 U4.13
SDO: length 6.3
  Top Layer w0.254: U4.14 32.52,17.39 H4.1
$1N550: length 3.4
  Top Layer w0.254: R52.2 83.65,32.62 U11.1 U11.2
$1N551: length 2.4
  Top Layer w0.254: U11.3 83.3,30.08 82.68,30.7 R54.1
$1N563: length 56.5
  Top Layer w0.254: v2(78.36,31.75) 78.97,31.75 R54.2 ; R51#3.2 R50#3.2 v2(60.93,49.1)
  Bottom Layer w0.254: v2(78.36,31.75) 78.36,43.05 83.19,47.88 83.19,52.45 80.26,55.37 62.99,55.37 60.93,53.31 v2(60.93,49.1)
$1N579: length 4
  Top Layer w0.254: R56.1 12.15,6.55 12.15,7.79 11.34,8.6 U12.5
$1N581: length 4.7
  Top Layer w0.254: U12.3 10.39,11.13 10.64,10.88 14.01,10.88 C23.1
$1N582: length 2.2
  Top Layer w0.254: 14.26,9.73 13.61,9.08 U12.6
$1N1171: length 8.7
  Top Layer w0.254: U6#4.1 66.18,50.63 R41#4.1 ; R41#3.1 28.97,50.89 U6#2.1 ; R41#2.1 47.76,50.63 U6#3.1 ; R41.1 10.43,51.01 U6.1
$1N1172: length 10.4
  Top Layer w0.254: U6#2.4 27.8,47.07 R42#2.1 ; R42#3.1 65.02,46.82 U6#4.4 ; U6.4 9.26,47.2 R42.1 ; R42#4.1 46.6,46.82 U6#3.4
$1N1174: length 38.8
  Top Layer w0.254: U8#2.2 31.5,42.24 33.15,40.59 33.15,37.42 33.9,36.66 R46.1 34.64,36.76 C14#3.2 ; C14#4.2 71.85,36.5 R46#4.1 71.11,36.41 70.36,37.16 70.36,40.34 68.71,41.99 67.91,41.99 ; U8#4.2 50.29,41.99 51.94,40.34 51.94,37.16 52.7,36.41 R46#3.1 53.44,36.5 C14#2.2 ; U8.2 12.95,42.37 14.61,40.72 14.61,37.54 15.36,36.79 R46#2.1 16.1,36.89 C14.2
$1N1175: length 17.9
  Top Layer w0.254: C13#3.1 62.66,42.23 R44#3.1 62.66,41.27 R43#4.1 ; C13#2.1 25.45,42.48 R44#2.1 25.45,41.52 R43.1 ; C13.1 6.91,42.61 R44.1 6.91,41.65 R43#2.1 ; C13#4.1 44.25,42.23 R44#4.1 44.25,41.27 R43#3.1
$1N1177: length 45
  Top Layer w0.254: U6#2.7 33.91,49.61 29.59,45.29 26.86,45.29 C13#2.2 ; U6#3.7 52.71,49.36 48.39,45.04 45.66,45.04 44.38,43.77 ; C13#3.2 64.07,45.04 66.8,45.04 71.12,49.36 U6#4.7 ; U6.7 15.37,49.74 11.05,45.42 8.32,45.42 C13.2
$1N1178: length 8
  Top Layer w0.254: C15.1 19.43,34.91 R47.1 ; C15#3.1 56.77,34.53 R47#3.1 ; C15#2.1 37.97,34.78 R47#4.1 ; R47#2.1 75.18,34.53 C15#4.1
$1N1179: length 78.3
  Top Layer w0.254: U9#2.2 28.22,31.38 C16#3.2 25.4,32.4 25.4,33.73 26.92,35.26 31.61,35.26 R48#2.1 33.14,35.26 35.99,35.26 R47#4.2 ; U9.2 9.68,31.51 C16#2.2 6.86,32.53 6.86,33.86 8.38,35.39 13.07,35.39 R48.1 14.6,35.39 17.45,35.39 R47.2 ; R47#2.2 73.2,35 70.35,35 R48#3.1 68.83,35 64.13,35 62.61,33.48 62.61,32.15 C16.2 65.43,31.13 U9#4.2 ; U9#3.2 47.01,31.13 C16#4.2 44.2,32.15 44.2,33.48 45.72,35 50.41,35 R48#4.1 51.93,35 54.78,35 R47#3.2
$1N1180: length 51.3
  Top Layer w0.254: R48#2.2 29.22,32.85 U9#2.1 ; R49#3.1 69.09,28.01 69.09,29.48 65.98,32.59 U9#4.1 ; C16#3.1 28.35,32.78 U9#2.1 ; U9#2.1 28.77,32.85 31.88,29.74 31.88,28.26 R49#2.1 ; U9#4.1 66.43,32.59 R48#3.2 ; U9#4.1 65.56,32.53 C16.1 ; U9#3.1 47.56,32.59 50.67,29.48 50.67,28.01 R49#4.1 ; U9#3.1 47.14,32.53 C16#4.1 ; U9#3.1 48.01,32.59 R48#4.2 ; R49.1 13.33,28.39 13.33,29.86 10.23,32.97 U9.1 ; R48.2 10.68,32.97 U9.1 ; U9.1 9.81,32.91 C16#2.1
$1N1181: length 52.5
  Top Layer w0.254: C17.1 10.22,43.64 U8.1 13.37,43.64 16,41.01 R46#2.2 19.38,38.3 C15.2 ; C17#4.1 47.56,43.26 U8#4.1 50.71,43.26 53.34,40.63 R46#3.2 56.72,37.92 C15#3.2 ; C15#4.2 75.13,37.92 R46#4.2 71.75,40.63 69.12,43.26 65.98,43.26 C17#3.1 ; C15#2.2 37.92,38.17 R46.2 34.54,40.88 31.91,43.51 U8#2.1 28.77,43.51 C17#2.1
$1N1182: length 14.1
  Top Layer w0.254: R45#3.1 65.91,40.29 C17#3.2 65.87,41.97 R44#3.2 ; R44.2 10.12,42.35 C17.2 10.16,40.67 R45.1 ; R45#2.1 28.7,40.54 C17#2.2 28.66,42.22 R44#2.2 ; R45#4.1 47.5,40.29 C17#4.2 47.45,41.97 R44#4.2
$1N1184: length 24.7
  Top Layer w0.254: R45#2.2 28.53,39.02 ; 28.53,39.02 28.64,38.91 C18.1 28.43,38.77 28.43,38.93 28.53,39.02 ; 28.53,39.02 29.46,39.96 29.46,40.1 30.34,40.97 U8#2.3 ; 9.99,39.15 10.92,40.08 10.92,40.23 11.79,41.1 U8.3 ; 9.99,39.15 9.89,39.05 9.89,38.89 C18#2.1 10.1,39.04 9.99,39.15 ; 9.99,39.15 R45.2 ; 47.33,38.77 47.23,38.67 47.23,38.51 C18#4.1 47.44,38.66 47.33,38.77 ; 47.33,38.77 48.26,39.7 48.26,39.85 49.13,40.72 U8#4.3 ; 47.33,38.77 R45#4.2 ; 65.74,38.77 65.65,38.67 65.65,38.51 C18#3.1 65.85,38.66 65.74,38.77 ; 65.74,38.77 R45#3.2 ; 65.74,38.77 66.68,39.7 66.68,39.85 67.55,40.72 67.91,40.72
$1N1186: length 9.2
  Top Layer w0.254: R50.1 8.5,49.74 U6.2 ; U6#3.2 45.84,49.36 R50#4.1 ; R50#3.1 64.25,49.36 U6#4.2 ; U6#2.2 27.04,49.61 R50#2.1
$1N1187: length 9.8
  Top Layer w0.254: U6#4.3 64.63,48.09 R51#3.1 ; U6#3.3 46.22,48.09 R51#4.1 ; R51#2.1 27.42,48.34 U6#2.3 ; U6.3 8.88,48.47 R51.1
$1N1199: length 5
  Top Layer w0.254: R50.2 R51.2 ; R50#4.2 R51#4.2 ; R50#2.2 R51#2.2
$1N1200: length 12.1
  Top Layer w0.254: R41#2.2 46.74,53.29 H12.1 ; 29.34,53.55 27.95,53.55 26.8,52.39 ; R41.2 9.41,53.67 10.8,53.67 ; R41#4.2 65.16,53.29 H12#5.1
$1N1286: length 4.4
  Top Layer w0.254: C9.1 21.55,14.84 21.55,15.8 22.64,16.89 U4.3
$1N1288: length 2.9
  Top Layer w0.254: U4.6 24.03,14.14 R57.1
$1N1289: length 2.4
  Top Layer w0.254: R58.1 24.53,13 U4.7
$1N1290: length 3.8
  Top Layer w0.254: U4.9 25.53,14.21 26.12,13.63 27.14,13.63 27.52,13.25 27.52,12.99 R59.1
$1N1291: length 2
  Top Layer w0.254: U4.19 24.53,19.53 R61.2
$1N1292: length 1.8
  Top Layer w0.254: R62.2 25.03,20.19 U4.18
$1N1293: length 2.5
  Top Layer w0.254: U4.17 25.53,19.38 26.39,20.23 26.5,20.23 26.71,20.44 R63.1
$1N1294: length 3.2
  Top Layer w0.254: U4.16 27,19.73 27.86,19.73 R64.1
$1N1295: length 2.7
  Top Layer w0.254: R65.2 25.03,13.69 U4.8
$1N1305: length 7.4
  Top Layer w0.254: C10.1 20.91,15.79 22.51,17.39 U4.2 ; 20.6,15.66 19.9,16.36 19.9,18.08 19.14,18.83 R168.1
$1N1306: length 1.8
  Top Layer w0.254: R167.1 R168.2
$1N1316: length 6
  Top Layer w0.254: R57.2 19.77,8.37 H3.4
$1N1581: length 6.2
  Top Layer w0.254: H5#2.1 H5#2.2 83.19,44.7 R55.1
$1N2313: length 12.3
  Top Layer w0.254: R52.1 83.68,34.12 84.96,35.4 84.96,37.17 84.38,37.76 U10.2 83.48,37.69 82.71,37.69 81.41,38.99 R53.2 81.35,39.4 C20.1
$1N2328: length 5.8
  Top Layer w0.254: U10.1 83.19,38.78 83.19,40.24 82.57,40.85 R53.1 81.35,40.8 C20.2
$1N6910: length 5.6
  Top Layer w0.254: H3.3 24.27,8.36 R58.2
$1N6915: length 5.3
  Top Layer w0.254: R65.1 25.99,7.53 H3.2
$1N6920: length 5
  Top Layer w0.254: R59.2 27.77,6.77 H3.1
$1N10831: length 86
  Top Layer w0.254: R42#3.2 62.44,45.85 v2(61.47,45.85) ; R42#2.2 25.2,45.97 v2(24.38,45.97) ; R42#4.2 43.9,45.97 v2(43.05,45.97) ; v2(5.72,46.23) 5.76,46.18 R42.2
  Bottom Layer w0.254: 22.99,44.58 v2(24.38,45.97) ; 22.99,44.58 41.66,44.58 ; 22.99,44.58 7.37,44.58 v2(5.72,46.23) ; 41.66,44.58 60.2,44.58 ; 41.66,44.58 v2(43.05,45.97) ; 60.2,44.58 v2(61.47,45.85) ; 60.2,44.58 77.22,44.58 H12#3.1

## Copper pours and planes (outline as drawn; the poured copper is in the pictures)
AVCC on Inner1: 11.45,14.88 11.45,11.58 18.08,11.58 25.26,18.76 72.23,18.76 78.49,25.02 78.49,37.85 78.87,38.23 83.12,38.23 88.73,32.62 91.79,32.62 91.79,42.58 78.49,55.88 11.89,55.88 8.25,52.24 8.25,41.65 14.61,48.01 20.83,48.01 20.83,40.08 17.25,36.51 17.25,32.24 17.02,32 17.13,32 34.28,49.15 37.72,49.15 37.72,37.76 37.57,37.62 37.57,36.48 35.55,34.46 35.55,32.3 35.94,31.9 51.42,47.37 59.44,47.37 59.82,46.99 59.82,44.59 54.08,38.85 54.08,34.26 54.74,33.61 59.26,33.61 73.61,47.96 74.8,47.96 77.47,45.29 77.47,37.08 64.52,24.13 20.7,24.13
AVEE on Inner1: 15.88,46.55 19.24,46.55 19.43,46.35 19.43,41.66 15.11,37.34 15.11,30.11 16.06,29.16 16.97,29.16 35.53,47.73 37.29,47.73 37.29,42.24 35.81,40.77 35.81,36.95 34.13,35.26 34.13,31.03 34.8,30.35 38.23,30.35 53.67,45.79 57.4,45.79 57.4,44.32 52.45,39.37 52.45,33.65 53.42,32.69 62.14,32.69 62.14,34.97 72.96,45.79 75.2,45.79 75.2,38.06 61.78,24.64 15.31,24.64 8.15,31.8 8.15,38.83
GND on Top Layer: 0.89,57.42 0.89,29.59 5.21,25.27 13.72,25.27 17.78,21.21 17.78,7.24 13.84,3.3 30.48,3.3 31.37,4.19 32.84,4.19 34.25,5.59 34.25,20.28 35.56,21.59 88.77,21.59 91.31,24.13 91.31,56.13 90.02,57.42
GND on Top Layer: 36.96,21.08 46.61,21.08 47.62,20.07 47.62,9.27 44.96,9.27 43.31,7.62 37.57,7.62 35.74,9.45 35.74,19.87
GND on Top Layer: 4.06,8.64 9.4,3.3 12.32,3.3 16.89,7.87 16.89,20.07 15.32,21.63 12.91,21.63 9.97,24.57 5.49,24.57 4.02,23.11
GND on Bottom Layer: -4.19,65.02 93.98,65.02 93.98,-1.27 -4.19,-1.27
GND on Inner2: -2.29,62.99 96.14,62.99 96.14,-6.22 -2.29,-6.22
